# Altium schematic sheet Jonathan ESC.SchDoc: Jonathan ESC Full
size A
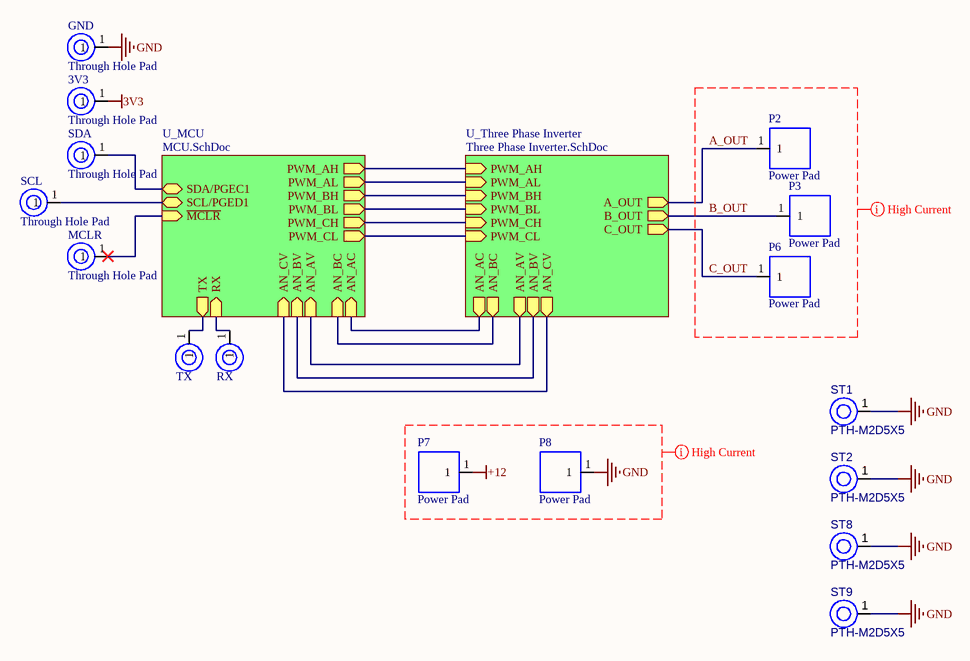
[diagram p0: Jonathan ESC.SchDoc]

## Parts
3V3  Through Hole Pad  [THROUGH HOLE PAD]
GND  Through Hole Pad  [THROUGH HOLE PAD]
MCLR  Through Hole Pad  [THROUGH HOLE PAD]
P2  Power Pad  [Power Pad]  (no BOM)
P3  Power Pad  [Power Pad]  (no BOM)
P6  Power Pad  [Power Pad]  (no BOM)
P7  Power Pad  [Power Pad]  (no BOM)
P8  Power Pad  [Power Pad]  (no BOM)
RX  RX  [THROUGH HOLE PAD]  (value not drawn)
SCL  Through Hole Pad  [THROUGH HOLE PAD]
SDA  Through Hole Pad  [THROUGH HOLE PAD]
ST1  PTH-M2D5X5  [PTH-M2D5X5]
ST2  PTH-M2D5X5  [PTH-M2D5X5]
ST8  PTH-M2D5X5  [PTH-M2D5X5]
ST9  PTH-M2D5X5  [PTH-M2D5X5]
TX  TX  [THROUGH HOLE PAD]  (value not drawn)

## Sub-sheets
U_MCU = MCU.SchDoc: SCL/PGED1 (bidir), SDA/PGEC1 (bidir), PWM_CL (out), PWM_AH (out), PWM_AL (out), PWM_BH (out), PWM_CH (out), PWM_BL (out), ~{MCLR} (in), AN_BV (in), AN_AV (in), AN_CV (in), AN_BC (in), AN_AC (in), TX (out), RX (in)
U_Three Phase Inverter = Three Phase Inverter.SchDoc: C_OUT (out), AN_AC (out), A_OUT (out), AN_BV (out), AN_BC (out), PWM_AL (in), B_OUT (out), PWM_BL (in), AN_CV (out), PWM_CL (in), PWM_AH (in), PWM_CH (in), AN_AV (out), PWM_BH (in)

## Nets
3V3: 3V3.1
+12: P7.1
GND: GND.1 P8.1 ST1.1(H1) ST2.1(H1) ST8.1(H1) ST9.1(H1)
A_OUT: P2.1 ; sheet U_Three Phase Inverter/A_OUT
B_OUT: P3.1 ; sheet U_Three Phase Inverter/B_OUT
C_OUT: P6.1 ; sheet U_Three Phase Inverter/C_OUT
NetMCLR_1: MCLR.1 ; sheet U_MCU/~{MCLR}
NetRX_1: RX.1 ; sheet U_MCU/RX
NetSCL_1: SCL.1 ; sheet U_MCU/SCL/PGED1
NetSDA_1: SDA.1 ; sheet U_MCU/SDA/PGEC1
NetTX_1: TX.1 ; sheet U_MCU/TX
(unnamed): sheet U_MCU/PWM_CL, sheet U_Three Phase Inverter/PWM_CL
(unnamed): sheet U_MCU/PWM_AH, sheet U_Three Phase Inverter/PWM_AH
(unnamed): sheet U_MCU/PWM_AL, sheet U_Three Phase Inverter/PWM_AL
(unnamed): sheet U_MCU/PWM_BH, sheet U_Three Phase Inverter/PWM_BH
(unnamed): sheet U_MCU/PWM_CH, sheet U_Three Phase Inverter/PWM_CH
(unnamed): sheet U_MCU/PWM_BL, sheet U_Three Phase Inverter/PWM_BL
(unnamed): sheet U_MCU/AN_BV, sheet U_Three Phase Inverter/AN_BV
(unnamed): sheet U_MCU/AN_AV, sheet U_Three Phase Inverter/AN_AV
(unnamed): sheet U_MCU/AN_CV, sheet U_Three Phase Inverter/AN_CV
(unnamed): sheet U_MCU/AN_BC, sheet U_Three Phase Inverter/AN_BC
(unnamed): sheet U_MCU/AN_AC, sheet U_Three Phase Inverter/AN_AC

## Layout directives
net class High Current: +12, A_OUT, B_OUT, C_OUT, GND

## Notes on the sheet
- Title
- Size:
- Date:
- A
- Number:
- Time:
- Revision:
- Sheet
- of
- File:

## Library data of the parts
RX TX = Through Hole Pad
ST1 ST2 ST8 ST9 = CMP-00028-00004-1: M2 PTH (2.5mm), 5mm pad; Pins: 1